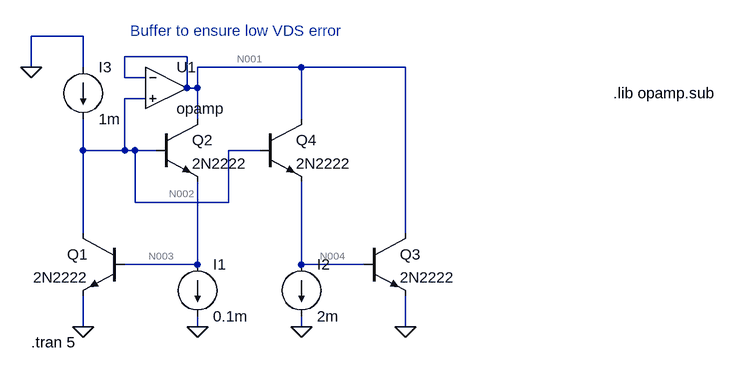
[diagram p0: schematic translinear_ratio_1.asc]
translinear_ratio_1.asc, the LTspice schematic file:
Version 4
SHEET 1 1132 680
WIRE 144 -224 64 -224
WIRE 304 -192 208 -192
WIRE 64 -176 64 -224
WIRE 144 -176 144 -224
WIRE 480 -176 320 -176
WIRE 640 -176 480 -176
WIRE 208 -160 208 -192
WIRE 240 -160 208 -160
WIRE 304 -144 304 -192
WIRE 320 -144 320 -176
WIRE 320 -144 304 -144
WIRE 240 -128 208 -128
WIRE 320 -96 320 -144
WIRE 480 -96 480 -176
WIRE 144 -48 144 -96
WIRE 208 -48 208 -128
WIRE 208 -48 144 -48
WIRE 224 -48 208 -48
WIRE 256 -48 224 -48
WIRE 416 -48 368 -48
WIRE 224 32 224 -48
WIRE 368 32 368 -48
WIRE 368 32 224 32
WIRE 144 80 144 -48
WIRE 640 80 640 -176
WIRE 320 128 320 0
WIRE 320 128 208 128
WIRE 480 128 480 0
WIRE 576 128 480 128
WIRE 144 224 144 176
WIRE 320 224 320 208
WIRE 480 224 480 208
WIRE 640 224 640 176
FLAG 144 224 0
FLAG 320 224 0
FLAG 640 224 0
FLAG 480 224 0
FLAG 64 -176 0
SYMBOL npn 208 80 M0
SYMATTR InstName Q1
SYMATTR Value 2N2222
SYMBOL npn 256 -96 R0
SYMATTR InstName Q2
SYMATTR Value 2N2222
SYMBOL npn 576 80 R0
SYMATTR InstName Q3
SYMATTR Value 2N2222
SYMBOL npn 416 -96 R0
SYMATTR InstName Q4
SYMATTR Value 2N2222
SYMBOL current 320 128 R0
WINDOW 123 0 0 Left 0
WINDOW 39 0 0 Left 0
SYMATTR InstName I1
SYMATTR Value 0.1m
SYMBOL current 480 128 R0
WINDOW 123 0 0 Left 0
WINDOW 39 0 0 Left 0
SYMATTR InstName I2
SYMATTR Value 2m
SYMBOL current 144 -176 R0
WINDOW 123 0 0 Left 0
WINDOW 39 0 0 Left 0
SYMATTR InstName I3
SYMATTR Value 1m
SYMBOL Opamps\\opamp 272 -208 R0
SYMATTR InstName U1
TEXT 64 248 Left 2 !.tran 5
TEXT 960 -136 Left 2 !.lib opamp.sub
TEXT 216 -232 Left 2 ;Buffer to ensure low VDS error

The netlist it stands for:
* translinear_ratio_1.asc
Q1 N002 N003 0 0 2N2222
Q2 N001 N002 N003 0 2N2222
Q3 N001 N004 0 0 2N2222
Q4 N001 N002 N004 0 2N2222
I1 N003 0 0.1m
I2 N004 0 2m
I3 0 N002 1m
XU1 N001 N002 N001 opamp Aol=100K GBW=10Meg  ; pins invin noninvin out
.model NPN NPN
.model PNP PNP
.lib standard.bjt
.tran 5
.lib opamp.sub
* Buffer to ensure low VDS error
.backanno
.end

* Results of the author's LTspice run, read from the files saved beside the schematic
* Operating Point, zero values left out:
*   V(n002) = 1.252 V
*   V(n003) = 655 mV
*   V(n001) = 1.252 V
*   V(n004) = 578.1 mV
*   Ic(Q4) = 1.99 mA
*   Ib(Q4) = 10.02 µA
*   Ie(Q4) = -2 mA
*   Ic(Q3) = 51.31 µA
*   Ib(Q3) = 254.9 nA
*   Ie(Q3) = -51.56 µA
*   Ic(Q2) = 104.4 µA
*   Ib(Q2) = 522.2 nA
*   Ie(Q2) = -104.9 µA
*   Ic(Q1) = 989.5 µA
*   Ib(Q1) = 4.934 µA
*   Ie(Q1) = -994.4 µA
*   I(I3) = 1 mA
*   I(I2) = 2 mA
*   I(I1) = 100 µA
*   Ix(u1:3) = -2.146 mA
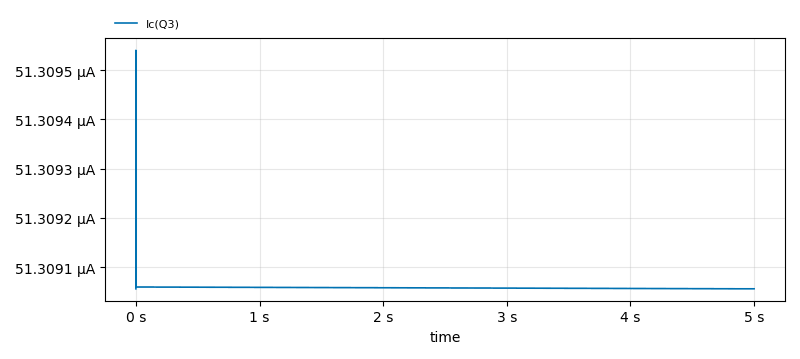
[diagram p1: Transient Analysis of translinear_ratio_1.asc, plotted from the saved traces]
* Transient Analysis, 1 run:
*   Ic(Q3): min 51.31 µA, max 51.31 µA, average 51.31 µA, rms 51.31 µA, last 51.31 µA